# EasyEDA Pro project 15P2D_EDA.eprj

# Schematic SCH

## Sheets
1 P1: Create Date: 2024-03-08; Page Name: P1; Project Name: 15P2_EDA; Schematic Name: SCH; Update Date: 2024-03-23; Company: 嘉立创EDA; Page Size: A4; Version: V1.0
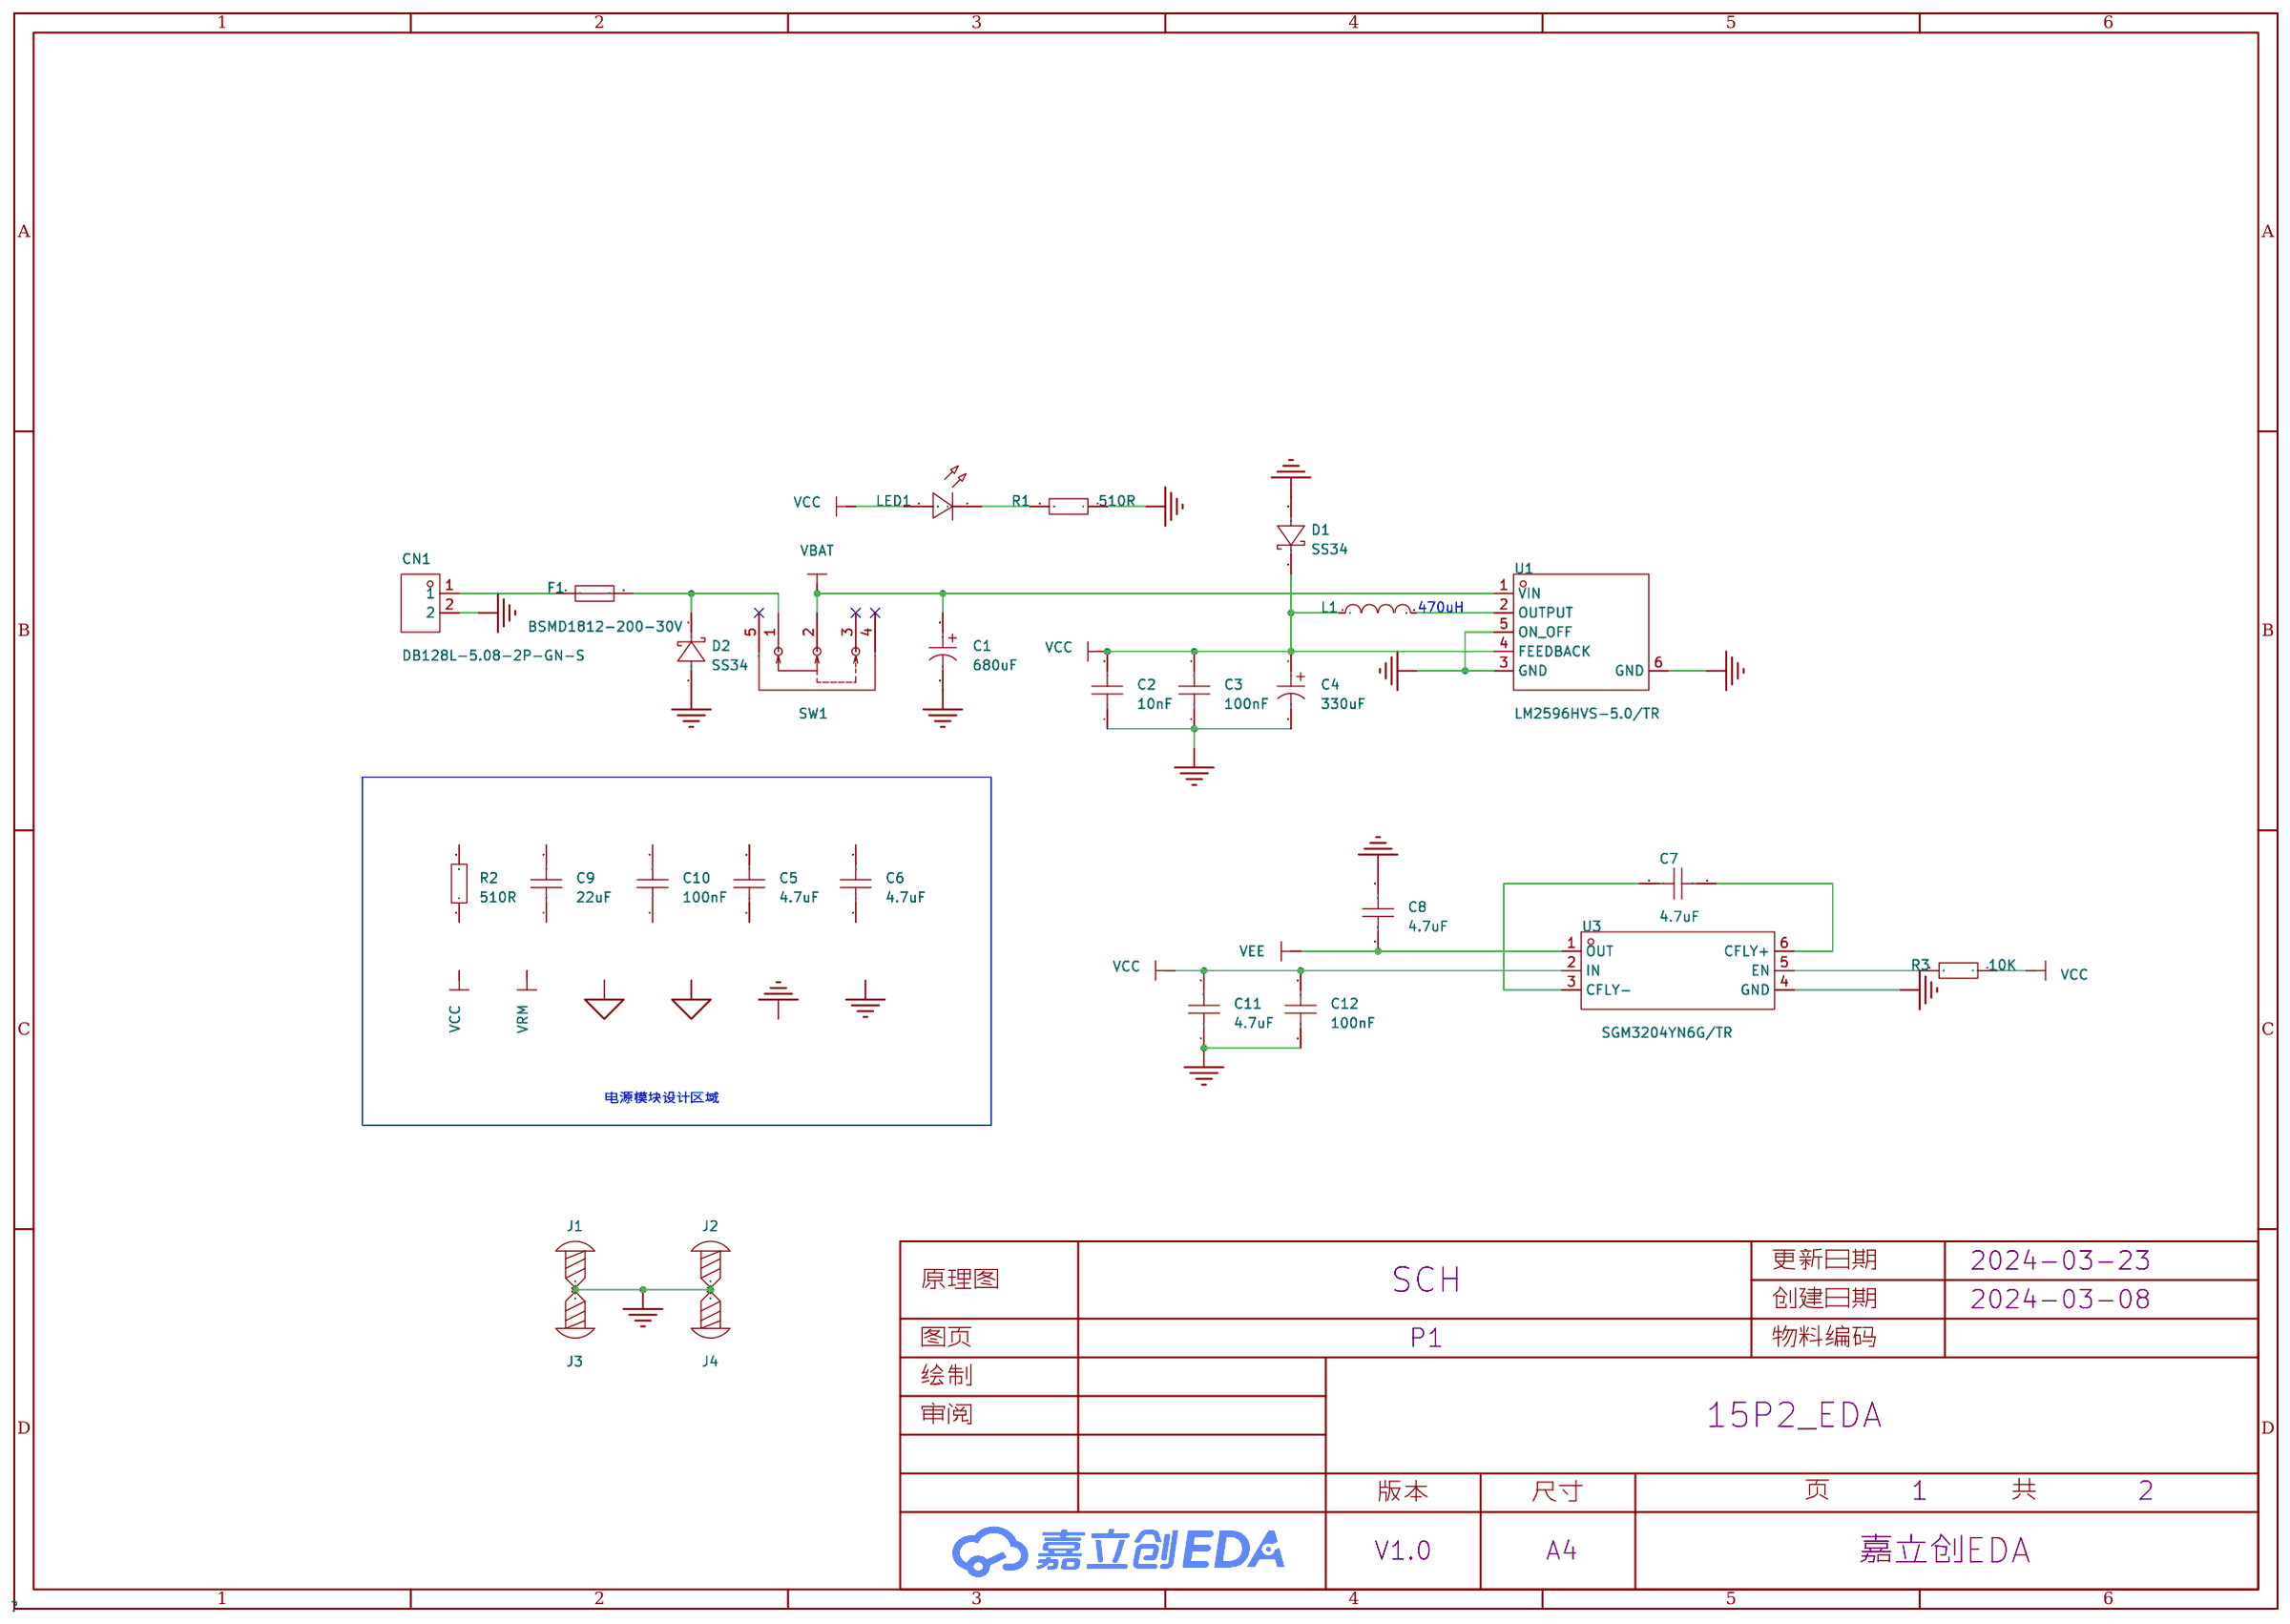
[diagram p0: P1]
2 P2: Create Date: 2024-03-11; Page Name: P2; Update Date: 2024-04-10; Company: EDA设计与开发
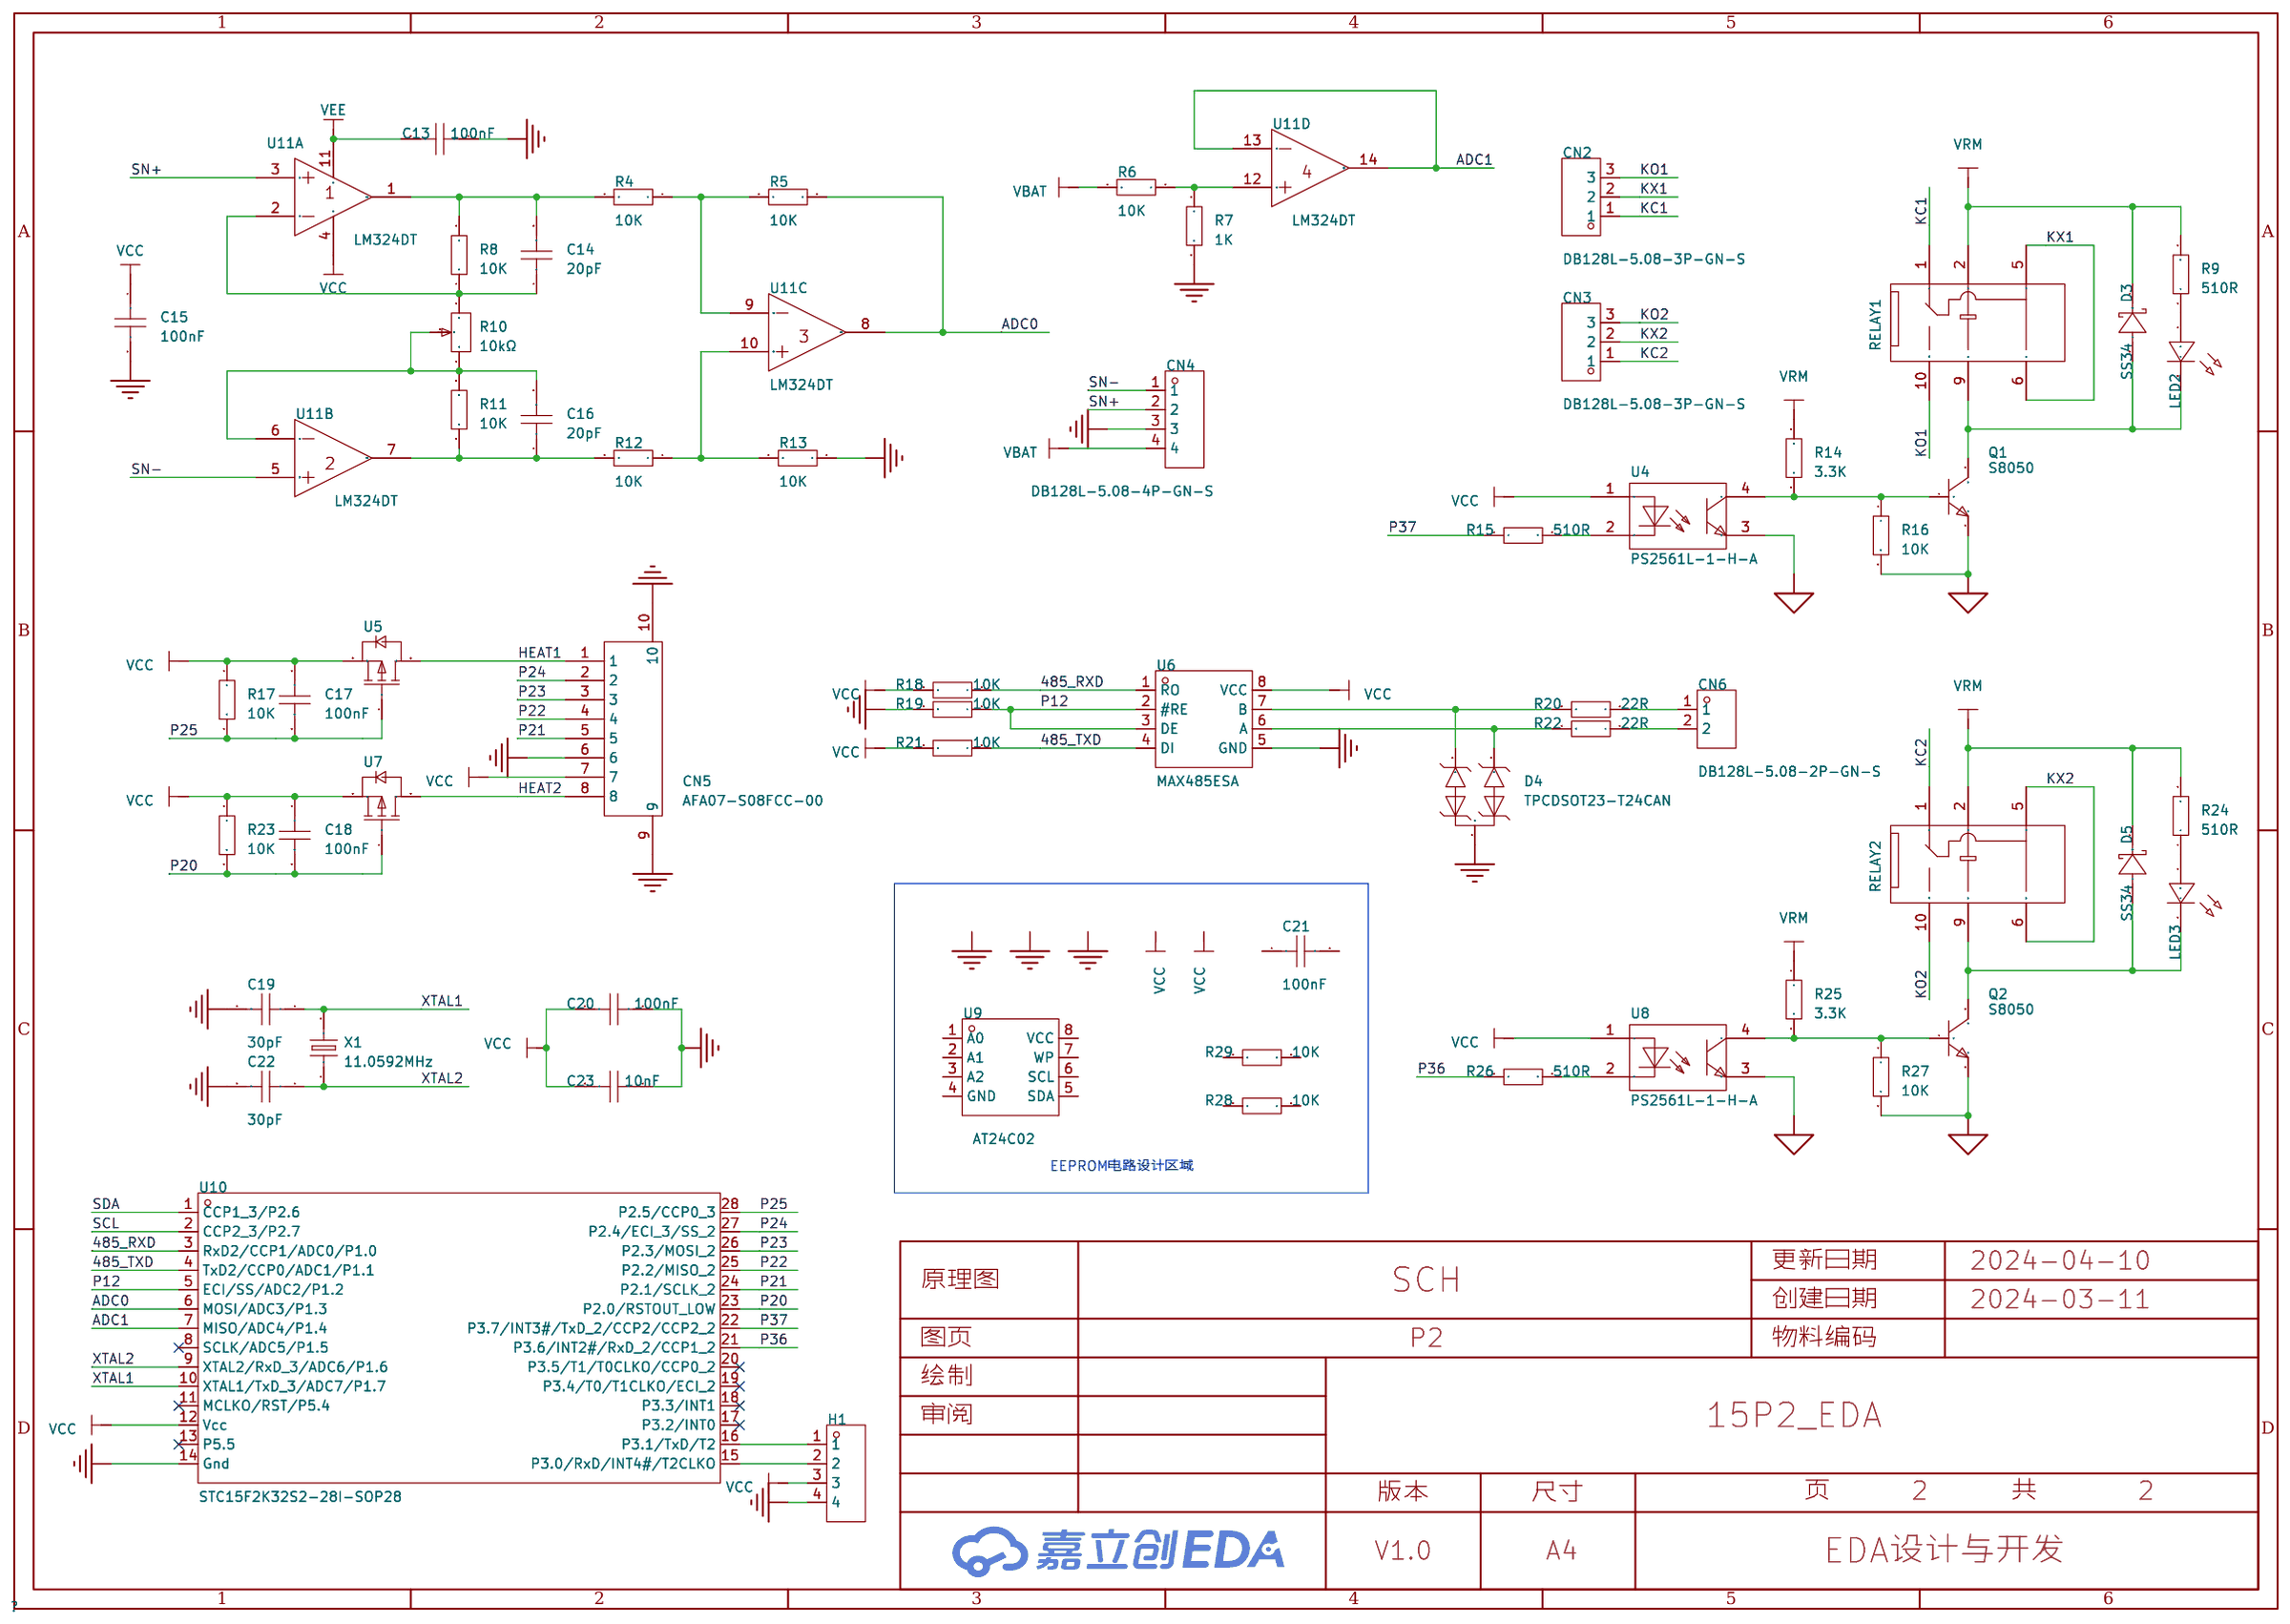
[diagram p1: P2]

## Parts
sheet P1
C1  680uF  [CAP-SMD_BD10.0-L10.3-W10.3-LS11.3-FD]
C2  10nF  [C0805]
C3  100nF  [C0805]
C4  330uF  [CAP-SMD_BD6.3-L6.6-W6.6-LS7.6-RD]
C5  4.7uF  [C1206]
C6  4.7uF  [C1206]
C7  4.7uF  [C1206]
C8  4.7uF  [C1206]
C9  22uF  [C1206]
C10  100nF  [C0805]
C11  4.7uF  [C1206]
C12  100nF  [C0805]
CN1  DB128L-5.08-2P-GN-S  [CONN-TH_2P-P5.08_DB128L-5.08-2P]
D1  SS34  [SMA_L4.3-W2.5-LS5.0-RD]
D2  SS34  [SMA_L4.3-W2.5-LS5.0-RD]
F1  BSMD1812-200-30V  [F1812]
J1  -  [M2螺丝]
J2  -  [M2螺丝]
J3  -  [M2螺丝]
J4  -  [M2螺丝]
L1  470uH  [IND-SMD_L12.0-W12.0_YPRH120X]
LED1  -  [LED_TH-3mm]
R1  510R  [R0805]
R2  510R  [R0805]
R3  10K  [R0805]
SW1  SK12D07VG4  [SW-TH_SK12D07VG4]
U1  LM2596HVS-5.0/TR  [TO-263-5_L10.2-W8.9-P1.70-LS15.2-BR]
U3  SGM3204YN6G/TR  [SOT-23-6_L2.9-W1.6-P0.95-LS2.8-BR]
sheet P2
C13  100nF  [C0805]
C14  20pF  [C0805]
C15  100nF  [C0805]
C16  20pF  [C0805]
C17  100nF  [C0805]
C18  100nF  [C0805]
C19  30pF  [C0805]
C20  100nF  [C0805]
C21  100nF  [C0805]
C22  30pF  [C0805]
C23  10nF  [C0805]
CN2  DB128L-5.08-3P-GN-S  [CONN-TH_DB128L-5.08-3P]
CN3  DB128L-5.08-3P-GN-S  [CONN-TH_DB128L-5.08-3P]
CN4  DB128L-5.08-4P-GN-S  [CONN-TH_4P_DB128L-5.08-4P-GN-S]
CN5  AFA07-S08FCC-00  [FPC-SMD_P1.00-8P_LCS-XJ-H2.5]
CN6  DB128L-5.08-2P-GN-S  [CONN-TH_2P-P5.08_DB128L-5.08-2P]
D3  SS34  [SMA_L4.3-W2.5-LS5.0-RD]
D4  TPCDSOT23-T24CAN  [SOT-23-3_L2.9-W1.3-P1.90-LS2.4-BR]
D5  SS34  [SMA_L4.3-W2.5-LS5.0-RD]
H1  -  [HDR-TH_4P-P2.54-V-F]
LED2  -  [LED_TH-3mm]
LED3  -  [LED_TH-3mm]
Q1  S8050  [SOT-23-3_L2.9-W1.3-P1.90-LS2.4-BR]
Q2  S8050  [SOT-23-3_L2.9-W1.3-P1.90-LS2.4-BR]
R4  10K  [R0805]
R5  10K  [R0805]
R6  10K  [R0805]
R7  1K  [R0805]
R8  10K  [R0805]
R9  510R  [R0805]
R10  10kΩ  [RES-ADJ-TH_3P-L10.0-W10.0-P2.50-BL-BS]
R11  10K  [R0805]
R12  10K  [R0805]
R13  10K  [R0805]
R14  3.3K  [R0805]
R15  510R  [R0805]
R16  10K  [R0805]
R17  10K  [R0805]
R18  10K  [R0805]
R19  10K  [R0805]
R20  22R  [R0805]
R21  10K  [R0805]
R22  22R  [R0805]
R23  10K  [R0805]
R24  510R  [R0805]
R25  3.3K  [R0805]
R26  510R  [R0805]
R27  10K  [R0805]
R28  10K  [R0805]
R29  10K  [R0805]
RELAY1  G5V-1 DC5  [RELAY-TH_G5V-1]
RELAY2  G5V-1 DC5  [RELAY-TH_G5V-1]
U4  PS2561L-1-H-A  [SOP-4_L6.5-W4.6-P2.54-LS9.6-TL]
U5  SI2301-ZE  [SOT-23-3_L2.9-W1.3-P1.90-LS2.4-BR]
U6  MAX485ESA  [SOP-8_L5.0-W4.0-P1.27-LS6.0-BL]
U7  SI2301-ZE  [SOT-23-3_L2.9-W1.3-P1.90-LS2.4-BR]
U8  PS2561L-1-H-A  [SOP-4_L6.5-W4.6-P2.54-LS9.6-TL]
U9  AT24C02  [SOP-8_L4.9-W3.9-P1.27-LS6.0-BL]
U10  STC15F2K32S2-28I-SOP28  [SOP-28_L17.9-W7.5-P1.27-LS10.3-BL]
U11  LM324DT  [SOIC-14_L8.7-W3.9-P1.27-LS6.0-BL]  (sections 1,2,3,4)
X1  11.0592MHz  [HC-49US_L11.5-W4.5-P4.88]

## Library data of the parts
C1 = 126RV0105: 容值:680uF;精度:±20%;额定电压:35V;纹波电流:380mA;; LCSC Part Name: 680uF ±20% 35V; Supplier Part: C7461236; Manufacturer: KNSCHA(科尼盛); Supplier Footprint: SMD,D10xL10.5mm; JLCPCB Part Class: Extended Part; Datasheet: https://atta.szlcsc.com/upload/public/pdf/source/20230711/6451BDCB5B323B6F7EF00B061BF0BEEC.pdf; Supplier: LCSC; Tolerance: ±20%; Rated Voltage: 35V; Ripple Current: 380mA; φD: 10mm; L: 10.5mm; Lifetime @ Temp: 2000hrs@105℃; Operating Temperature: -55℃~+105℃
C2 C3 C10 C12-C23 = CAP_0805: Supplier Footprint: 0805
C4 = 126RV0107: 容值:330uF;精度:±20%;额定电压:16V;纹波电流:170mA;; LCSC Part Name: 330uF ±20% 16V; Supplier Part: C7461238; Manufacturer: KNSCHA(科尼盛); Supplier Footprint: SMD,D6.3xL7.7mm; JLCPCB Part Class: Extended Part; Datasheet: https://atta.szlcsc.com/upload/public/pdf/source/20230711/6451BDCB5B323B6F7EF00B061BF0BEEC.pdf; Supplier: LCSC; Tolerance: ±20%; Rated Voltage: 16V; Ripple Current: 170mA; φD: 6.3mm; L: 7.7mm; Lifetime @ Temp: 2000hrs@105℃; Operating Temperature: -55℃~+105℃
C5-C9 C11 = CL31A226KOHNNNE: 容值:22uF;精度:±10%;额定电压:16V;材质(温度系数):X5R;; LCSC Part Name: 22uF ±10% 16V; Supplier Part: C90146; Manufacturer: SAMSUNG(三星); Supplier Footprint: 1206; JLCPCB Part Class: 扩展库; Datasheet: https://atta.szlcsc.com/upload/public/pdf/source/20161228/1482890861309.pdf; Supplier: LCSC; Tolerance: ±10%; Voltage Rated: 16V; Temperature Coefficient: X5R
CN1 CN6 = DB128L-5.08-2P-GN-S: 结构:1x2P;间距:5.08mm;颜色:绿色;安装方式:直插;额定电流:18A;额定电压:250V;排数:1;线规 - AWG:12~30;线规 - 平方毫米:2.5;每排PIN数:2;工作温度范围:-40℃~+105℃;; LCSC Part Name: 5.08mm 1x2P 排数:1 每排P数:2 直插; Supplier Part: C395868; Manufacturer: DORABO(地博电气); Supplier Footprint: 插件,P=5.08mm; JLCPCB Part Class: 扩展库; Datasheet: https://atta.szlcsc.com/upload/public/pdf/source/20230106/B067FE0E641A396A370D47F93C345689.pdf; Supplier: LCSC; Structure: 1x2P; Pitch: 5.08mm; Color: 绿色; Mounting Style: 直插; Current Rating (Max): 18A; Voltage Rating (Max): 250V; Number of Pins: 2P; Number of Rows: 1; Wire Gauge - AWG: 12~30; Wire Gauge - mm2: 2.5; Number of PINs Per Row: 2; Operating Temperature Range: -40℃~+105℃
D1-D3 D5 = SS34_C727060: 二极管配置:独立式;正向压降(Vf):550mV@3A;直流反向耐压(Vr):40V;平均整流电流(Io):3A;; LCSC Part Name: 电压:40V 电流:3A; Supplier Part: C727060; Manufacturer: TWGMC(台湾迪嘉); Supplier Footprint: SMA(DO-214AC); JLCPCB Part Class: 扩展库; Datasheet: https://atta.szlcsc.com/upload/public/pdf/source/20200828/C727059_6599B6CAC5F3238B9C33E46794659DBE.pdf; Supplier: LCSC; Diode Configuration: 独立式; Forward Voltage (Vf@If): 550mV@3A; Reverse Voltage (Vr): 40V; Average Rectified Current (Io): 3A; Reverse Leakage Current (Ir): 500uA@40V
F1 = BSMD1812-200-30V: 最大电压:30V;最大电流:40A;保持电流:2A;跳闸电流:4A;; LCSC Part Name: 30V 2A 1812自恢复; Supplier Part: C960026; Manufacturer: BHFUSE(佰宏); Supplier Footprint: 1812; JLCPCB Part Class: 扩展库; Datasheet: https://atta.szlcsc.com/upload/public/pdf/source/20230512/6ED7FF50F668B3AF958C55F12246A840.pdf; Supplier: LCSC; Operating Voltage (Max): 30V; Current Rating (Max): 40A; Hold Current: 2A; Trip Current: 4A; Power Dissipation: 1W; Resistance - Initial (Ri) (Min): 20mΩ; Resistance - Post Trip (R1) (Max): 100mΩ; Maximum Time to Trip: 2s; Operating Temperature: -40℃~+85℃
J1-J4 = M2螺丝: Supplier Footprint: 插件
L1 = YPRH1209-471M: 电感值:470uH;精度:±20%;额定电流:1.06A;; LCSC Part Name: 470uH ±20%; Supplier Part: C718309; Manufacturer: YJYCOIN(益嘉源); Supplier Footprint: SMD,12x12mm; JLCPCB Part Class: 扩展库; Datasheet: https://atta.szlcsc.com/upload/public/pdf/source/20200623/C339955_D39FA66995A9BB8553FDBD7D9E6E5CB5.pdf; Supplier: LCSC; Tolerance: ±20%; Rated Current: 1.06A; DC Resistance (DCR): 471mΩ
LED1 = LED_TH-R_3mm: Supplier Footprint: 插件
R1-R9 R11-R29 = Res_0805: Supplier Footprint: 0805
SW1 = SK12D07VG4: 电路结构:单刀双掷;安装方式:侧插;额定电流(DC):500mA;额定电压(DC):50V;额定电流(AC):-;额定电压(AC):-;机械寿命:5千次;; LCSC Part Name: 3脚2档位 卧插 滑动开关; Supplier Part: C393937; Manufacturer: SHOU HAN(首韩); Supplier Footprint: 插件; JLCPCB Part Class: 扩展库; Datasheet: https://atta.szlcsc.com/upload/public/pdf/source/20190521/C393937_939FE26E571CC67D2D532E953108A1B0.pdf; Supplier: LCSC; Circuit: 单刀双掷; Actuator Style: 矩形柱状; Pin Style: PC引脚; Switch Height: 8.8mm; Mounting Style: 侧插; Current Rating (DC): 500mA; Voltage Rating (DC): 50V; Mechanical Life: 5千次
U1 = LM2596HVS-5.0/TR: Supplier Part: C7421039; Manufacturer: HGSEMI(华冠); Supplier Footprint: TO-263-5; Datasheet: https://atta.szlcsc.com/upload/public/pdf/source/20230608/50F81A07F1CB4120FC66F79925E72406.pdf; Supplier: LCSC
U3 = SGM3204YN6G/TR: 功能类型:-;输入电压:1.4V~5.5V;输出电压:-5.5V~-1.4V;输出电流(最大值):200mA;; Supplier Part: C194031; Manufacturer: SGMICRO(圣邦微); Supplier Footprint: SOT-23-6; JLCPCB Part Class: 扩展库; Datasheet: https://atta.szlcsc.com/upload/public/pdf/source/20180627/C194031_755051E53122D645C36CF727711B963E.pdf; Supplier: LCSC; Input Voltage: 1.4V~5.5V; Output Voltage: -5.5V~-1.4V; Output Current (Max): 200mA; Switching Frequency: 950kHz; Number of Outputs: 1; Switch tube (built-in/external): 内置
CN2 CN3 = DB128L-5.08-3P-GN-S: 结构:1x3P;间距:5.08mm;颜色:绿色;安装方式:直插;额定电流:18A;额定电压:250V;排数:1;线规 - AWG:12~30;线规 - 平方毫米:2.5;每排PIN数:3;工作温度范围:-40℃~+105℃;; LCSC Part Name: 5.08mm 1x3P 排数:1 每排P数:3 直插; Supplier Part: C395869; Manufacturer: DORABO(地博电气); Supplier Footprint: 插件,P=5.08mm; JLCPCB Part Class: 扩展库; Datasheet: https://atta.szlcsc.com/upload/public/pdf/source/20230106/B067FE0E641A396A370D47F93C345689.pdf; Supplier: LCSC; Structure: 1x3P; Pitch: 5.08mm; Color: 绿色; Mounting Style: 直插; Current Rating (Max): 18A; Voltage Rating (Max): 250V; Number of Pins: 3P; Number of Rows: 1; Wire Gauge - AWG: 12~30; Wire Gauge - mm2: 2.5; Number of PINs Per Row: 3; Operating Temperature Range: -40℃~+105℃
CN4 = DB128L-5.08-4P-GN-S: 结构:1x4P;间距:5.08mm;颜色:绿色;安装方式:直插;额定电流:18A;额定电压:250V;排数:1;线规 - AWG:12~30;线规 - 平方毫米:2.5;每排PIN数:4;工作温度范围:-40℃~+105℃;; LCSC Part Name: 5.08mm 1x4P 排数:1 每排P数:4 直插; Supplier Part: C2827883; Manufacturer: DORABO(地博电气); Supplier Footprint: 插件,P=5.08mm; JLCPCB Part Class: 扩展库; Datasheet: https://atta.szlcsc.com/upload/public/pdf/source/20230106/B067FE0E641A396A370D47F93C345689.pdf; Supplier: LCSC; Structure: 1x4P; Pitch: 5.08mm; Color: 绿色; Mounting Style: 直插; Current Rating (Max): 18A; Voltage Rating (Max): 250V; Number of Pins: 4P; Number of Rows: 1; Wire Gauge - AWG: 12~30; Wire Gauge - mm2: 2.5; Number of PINs Per Row: 4; Operating Temperature Range: -40℃~+105℃
CN5 = AFA07-S08FCC-00: 锁定特性:抽屉式;触点类型:下接;触点数量:8P;间距:1mm;安装类型:卧贴;; LCSC Part Name: 间距:1mm P数:8P 抽屉式 下接; Supplier Part: C262342; Manufacturer: JS(钜硕电子); Supplier Footprint: SMD,P=1mm,卧贴; JLCPCB Part Class: 扩展库; Datasheet: https://atta.szlcsc.com/upload/public/pdf/source/20191217/C262716_30B15E9A77BFCA4A54741C92DB3BE8CC.pdf; Supplier: LCSC; Locking Feature: 抽屉式; Contact Type: 下接; Number of Contacts: 8P; Pitch: 1mm; Mounting Type: 卧贴; FFC, FCB Thickness: 0.3mm; Height Above Board: 2.5mm
D4 = TPCDSOT23-T24CAN: Supplier Part: C970033; Manufacturer: TECH PUBLIC(台舟); Supplier Footprint: SOT-23; JLCPCB Part Class: 扩展库; Datasheet: https://atta.szlcsc.com/upload/public/pdf/source/20230522/C1F3B36253468277A14BE124FFAB154C.pdf; Supplier: LCSC
H1 = HDR-F_2.54_1x4P: Supplier Part: C2718488; Supplier Footprint: 插件
LED2 LED3 = LED_TH-G_3mm: Supplier Footprint: 插件
Q1 Q2 = S8050_C2891804: 晶体管类型:NPN;集电极电流(Ic):500mA;集射极击穿电压(Vceo):25V;功率(Pd):300mW;; LCSC Part Name: NPN 电流:500mA 耐压:25V; Supplier Part: C2891804; Manufacturer: YONGYUTAI(永裕泰); Supplier Footprint: SOT-23; JLCPCB Part Class: Extended Part; Datasheet: https://atta.szlcsc.com/upload/public/pdf/source/20210901/5347316A10609C628D4D69AE01446E5B.pdf; Supplier: LCSC; Transistor Type: NPN; Collector Current (Ic): 500mA; Collector-Emitter Breakdown Voltage (Vceo): 25V; Power Dissipation (Pd): 300mW; Collector Cut-Off Current (Icbo): 1uA; Collector-Emitter Saturation Voltage (VCE(sat)@Ic,Ib): 500mV@500mA,50mA
R10 = 3296W-1-203LF: 阻值:20kΩ;精度:±10%;功率:500mW;温度系数:±100ppm/℃;; LCSC Part Name: 20kΩ ±10%; Supplier Part: C34845; Manufacturer: BOURNS; Supplier Footprint: 插件; JLCPCB Part Class: 扩展库; Datasheet: https://atta.szlcsc.com/upload/public/pdf/source/20151026/1457707506403.pdf; Supplier: LCSC; Tolerance: ±10%; Power(Watts): 500mW; Temperature Coefficient: ±100ppm/℃; Turns: 25
RELAY1 RELAY2 = G5V-1 DC5: 线圈电压:5V;触点形式:一组转换:1C(单刀双掷-转换);触点容量(电阻负载):-;最大切换电压:125V@AC；60V@DC;最大切换电流:1A;; LCSC Part Name: 继电器G5V-1-5VDC; Supplier Part: C28695; Manufacturer: OMRON(欧姆龙); Supplier Footprint: DIP,7.5x12.5mm; JLCPCB Part Class: 扩展库; Supplier: LCSC; Coil Voltage: 5V; Contact Form: 一组转换:1C(单刀双掷-转换); Maximum Switching Voltage: 125V@AC；60V@DC; Contact Material: 银+镀金; Maximum Switching Current: 1A; Operate Time: 5ms; Release Time: 5ms; Operating Temperature: -40℃~+70℃
U4 U8 = PS2561L-1-H-A: Supplier Part: C145672; Manufacturer: California Eastern Laboratories; Supplier Footprint: SOP-4-2.54mm; JLCPCB Part Class: 扩展库; Datasheet: https://atta.szlcsc.com/upload/public/pdf/source/20180125/C145673_15168615431091301608.pdf; Supplier: LCSC
U5 U7 = SI2301-ZE: 类型:P沟道;漏源电压(Vdss):20V;连续漏极电流(Id):2.3A;功率(Pd):700mW;导通电阻(RDS(on)@Vgs,Id):126mΩ@4.5V;阈值电压(Vgs(th)@Id):1V@250uA;; LCSC Part Name: P沟道 耐压:20V 电流:2.3A; Supplier Part: C5261052; Manufacturer: HXY MOSFET(华轩阳电子); Supplier Footprint: SOT-23; JLCPCB Part Class: 扩展库; Datasheet: https://atta.szlcsc.com/upload/public/pdf/source/20230515/2FF2907841563ED329594D3237822724.pdf; Supplier: LCSC; Type: P沟道; Drain Source Voltage (Vdss): 20V; Continuous Drain Current (Id): 2.3A; Power Dissipation (Pd): 700mW; Drain Source On Resistance (RDS(on)@Vgs,Id): 126mΩ@4.5V; Gate Threshold Voltage (Vgs(th)@Id): 1V@250uA; Input Capacitance (Ciss@Vds): 285pF
U6 = MAX485ESA_C668206: Supplier Part: C668206; Manufacturer: UMW(友台半导体); Supplier Footprint: SOP-8; JLCPCB Part Class: 扩展库; Datasheet: https://atta.szlcsc.com/upload/public/pdf/source/20231109/489730AE87B90C4B6B8CE65C07B1054C.pdf; Supplier: LCSC
U9 = AT24C02_C7470930: 接口类型:I2C;存储容量:2Kbit;时钟频率(fc):400kHz~1MHz;; LCSC Part Name: AT24C02  2Kbit 12C; Supplier Part: C7470930; Manufacturer: HXY MOSFET(华轩阳电子); Supplier Footprint: SOP-8; JLCPCB Part Class: 扩展库; Datasheet: https://atta.szlcsc.com/upload/public/pdf/source/20230913/748AF0FF0068DF582FAC58AD968E8A28.pdf; Supplier: LCSC; Interface Type: I2C; Memory Size: 2Kbit; Clock Frequency (fc): 400kHz~1MHz; Supply Voltage: 1.8V~5.5V; Data Retention - TDR (Year): 100年
U10 = STC15F2K32S2-28I-SOP28: LCSC Part Name: STC15F2K32S2-28I- SOP28; Supplier Part: C194605; Manufacturer: STC(宏晶); Supplier Footprint: SOP-28-300mil; JLCPCB Part Class: 扩展库; Datasheet: https://atta.szlcsc.com/upload/public/pdf/source/20180730/C194606_29BB2C4DE21484D9E9511E7CB40FB26F.pdf; Supplier: LCSC
U11 = LM324DT: 放大器数:四路;增益带宽积(GBP):1.3MHz;输入偏置电流(Ib):20nA;压摆率(SR):0.4V/us;带宽(-3db):-;; Supplier Part: C71035; Manufacturer: ST(意法半导体); Supplier Footprint: SOIC-14; JLCPCB Part Class: 基础库; Datasheet: https://atta.szlcsc.com/upload/public/pdf/source/20160408/1460100649718.pdf; Supplier: LCSC; Number of Circuits: 四路; Gain Bandwidth Product(GBP): 1.3MHz; Current - Input Bias(Ib): 20nA; Slew Rate(SR): 0.4V/us; Output Current: 40mA; Supply Current: 1.5mA; Operating Temperature: 0℃~+70℃
X1 = TAXD11.0592M2GLFBET2T: 晶振类型:直插晶振;频率:11.0592MHz;常温频差:±30ppm;外接负载电容:20pF;频率稳定度(全温):±30ppm;; LCSC Part Name: 11.0592MHz ±30ppm 20pF; Supplier Part: C127675; Manufacturer: YJX(雅晶鑫); Supplier Footprint: HC-49S; JLCPCB Part Class: 扩展库; Datasheet: https://atta.szlcsc.com/upload/public/pdf/source/20170914/C127676_1505359415156967690.pdf; Supplier: LCSC; Crystal Type: 直插晶振; Normal temperature Frequency Tolerance: ±30ppm; External load capacitor: 20pF; Frequency Stability(Full temperature range): ±30ppm; Equivalent Series Resistance (ESR): 50Ω; Operating Temperature: -20℃~+70℃

## Nets
GND: C1.2 C2.1 C3.1 C4.2 C8.1 C11.1 C12.1 C13.1 C15.2 C19.2 C20.1 C22.2 C23.1 CN1.2 CN4.3 CN5.6 CN5.9 CN5.10 D1.2(A) D2.2(A) D4.3 H1.4 J1.1 J2.1 J3.1 J4.1 R1.1 R7.2 R13.1 R19.2 U1.3(GND) U1.5(ON_OFF) U1.6(GND) U3.4(GND) U6.5(GND) U10.14(Gnd)
VBAT: C1.1 CN4.4 R6.2 SW1.2 U1.1(VIN)
VCC: C2.2 C3.2 C4.1 C11.2 C12.2 C15.1 C17.1 C18.1 C20.2 C23.2 CN5.7 D1.1(C) H1.3 L1.1 LED1.1(C) R3.1 R17.1 R18.2 R21.2 R23.1 U1.4(FEEDBACK) U3.2(IN) U4.1 U5.2(S) U6.8(VCC) U7.2(S) U8.1 U10.12(Vcc) U11.4(VCC+)
VEE: C8.2 C13.2 U3.1(OUT) U11.11(VCC-)
0: Q1.2(E) Q2.2(E) R16.2 R27.2 U4.3 U8.3
485_RXD: R18.1 U6.1(RO) U10.3(RxD2/CCP1/ADC0/P1.0)
485_TXD: R21.1 U6.4(DI) U10.4(TxD2/CCP0/ADC1/P1.1)
ADC0: R5.1 U10.6(MOSI/ADC3/P1.3) U11.8(OUT3)
ADC1: U10.7(MISO/ADC4/P1.4) U11.13(IN4-) U11.14(OUT4)
HEAT1: CN5.1 U5.3(D)
HEAT2: CN5.8 U7.3(D)
KC1: CN2.1 RELAY1.1
KC2: CN3.1 RELAY2.1
KO1: CN2.3 RELAY1.10
KO2: CN3.3 RELAY2.10
KX1: CN2.2 RELAY1.5 RELAY1.6
KX2: CN3.2 RELAY2.5 RELAY2.6
P12: R19.1 U6.2(#RE) U6.3(DE) U10.5(ECI/SS/ADC2/P1.2)
P20: C18.2 R23.2 U7.1(G) U10.23(P2.0/RSTOUT_LOW)
P21: CN5.5 U10.24(P2.1/SCLK_2)
P22: CN5.4 U10.25(P2.2/MISO_2)
P23: CN5.3 U10.26(P2.3/MOSI_2)
P24: CN5.2 U10.27(P2.4/ECI_3/SS_2)
P25: C17.2 R17.2 U5.1(G) U10.28(P2.5/CCP0_3)
P36: R26.1 U10.21(P3.6/INT2#/RxD_2/CCP1_2)
P37: R15.1 U10.22(P3.7/INT3#/TxD_2/CCP2/CCP2_2)
SCL: U10.2(CCP2_3/P2.7)
SDA: U10.1(CCP1_3/P2.6)
SN+: CN4.2 U11.3(IN1+)
SN-: CN4.1 U11.5(IN2+)
VRM: D3.1(C) D5.1(C) R9.2 R14.1 R24.2 R25.1 RELAY1.2 RELAY2.2
XTAL1: C19.1 U10.10(XTAL1/TxD_3/ADC7/P1.7) X1.2
XTAL2: C22.1 U10.9(XTAL2/RxD_3/ADC6/P1.6) X1.1
Net-(C7-1): C7.1 U3.3(CFLY-)
Net-(C7-2): C7.2 U3.6(CFLY+)
Net-(C14-1): C14.1 R8.1 R10.1 U11.2(IN1-)
Net-(C14-2): C14.2 R4.2 R8.2 U11.1(OUT1)
Net-(C16-1): C16.1 R11.1 R12.2 U11.7(OUT2)
Net-(C16-2): C16.2 R10.2 R10.3 R11.2 U11.6(IN2-)
Net-(CN1-1): CN1.1 F1.1
Net-(CN6-1): CN6.1 R20.1
Net-(CN6-2): CN6.2 R22.1
Net-(D2-1): D2.1(C) F1.2 SW1.1
Net-(D3-2): D3.2(A) LED2.2(A) Q1.3(C) RELAY1.9
Net-(D4-1): D4.1 R22.2 U6.6(A)
Net-(D4-2): D4.2 R20.2 U6.7(B)
Net-(D5-2): D5.2(A) LED3.2(A) Q2.3(C) RELAY2.9
Net-(H1-1): H1.1 U10.16(P3.1/TxD/T2)
Net-(H1-2): H1.2 U10.15(P3.0/RxD/INT4#/T2CLKO)
Net-(L1-2): L1.2 U1.2(OUTPUT)
Net-(LED1-2): LED1.2(A) R1.2
Net-(LED2-1): LED2.1(C) R9.1
Net-(LED3-1): LED3.1(C) R24.1
Net-(Q1-1): Q1.1(B) R14.2 R16.1 U4.4
Net-(Q2-1): Q2.1(B) R25.2 R27.1 U8.4
Net-(R3-2): R3.2 U3.5(EN)
Net-(R4-1): R4.1 R5.2 U11.9(IN3-)
Net-(R6-1): R6.1 R7.1 U11.12(IN4+)
Net-(R12-1): R12.1 R13.2 U11.10(IN3+)
Net-(R15-2): R15.2 U4.2
Net-(R26-2): R26.2 U8.2

Not connected (* = marked no-connect by the designer): C5 1 2; C6 1 2; C9 1 2; C10 1 2; C21 1 2; R2 1 2; R28 1 2; R29 1 2; SW1 3* 4* 5*; U9 1(A0) 2(A1) 3(A2) 4(GND) 5(SDA) 6(SCL) 7(WP) 8(VCC); U10 8(SCLK/ADC5/P1.5)* 11(MCLKO/RST/P5.4)* 13(P5.5)* 17(P3.2/INT0)* 18(P3.3/INT1)* 19(P3.4/T0/T1CLKO/ECI_2)* 20(P3.5/T1/T0CLKO/CCP0_2)*

## Notes on the sheets
sheet 1
- 电源模块设计区域
sheet 2
- EEPROM电路设计区域
